# Altium project DeerDongle.PrjPcb
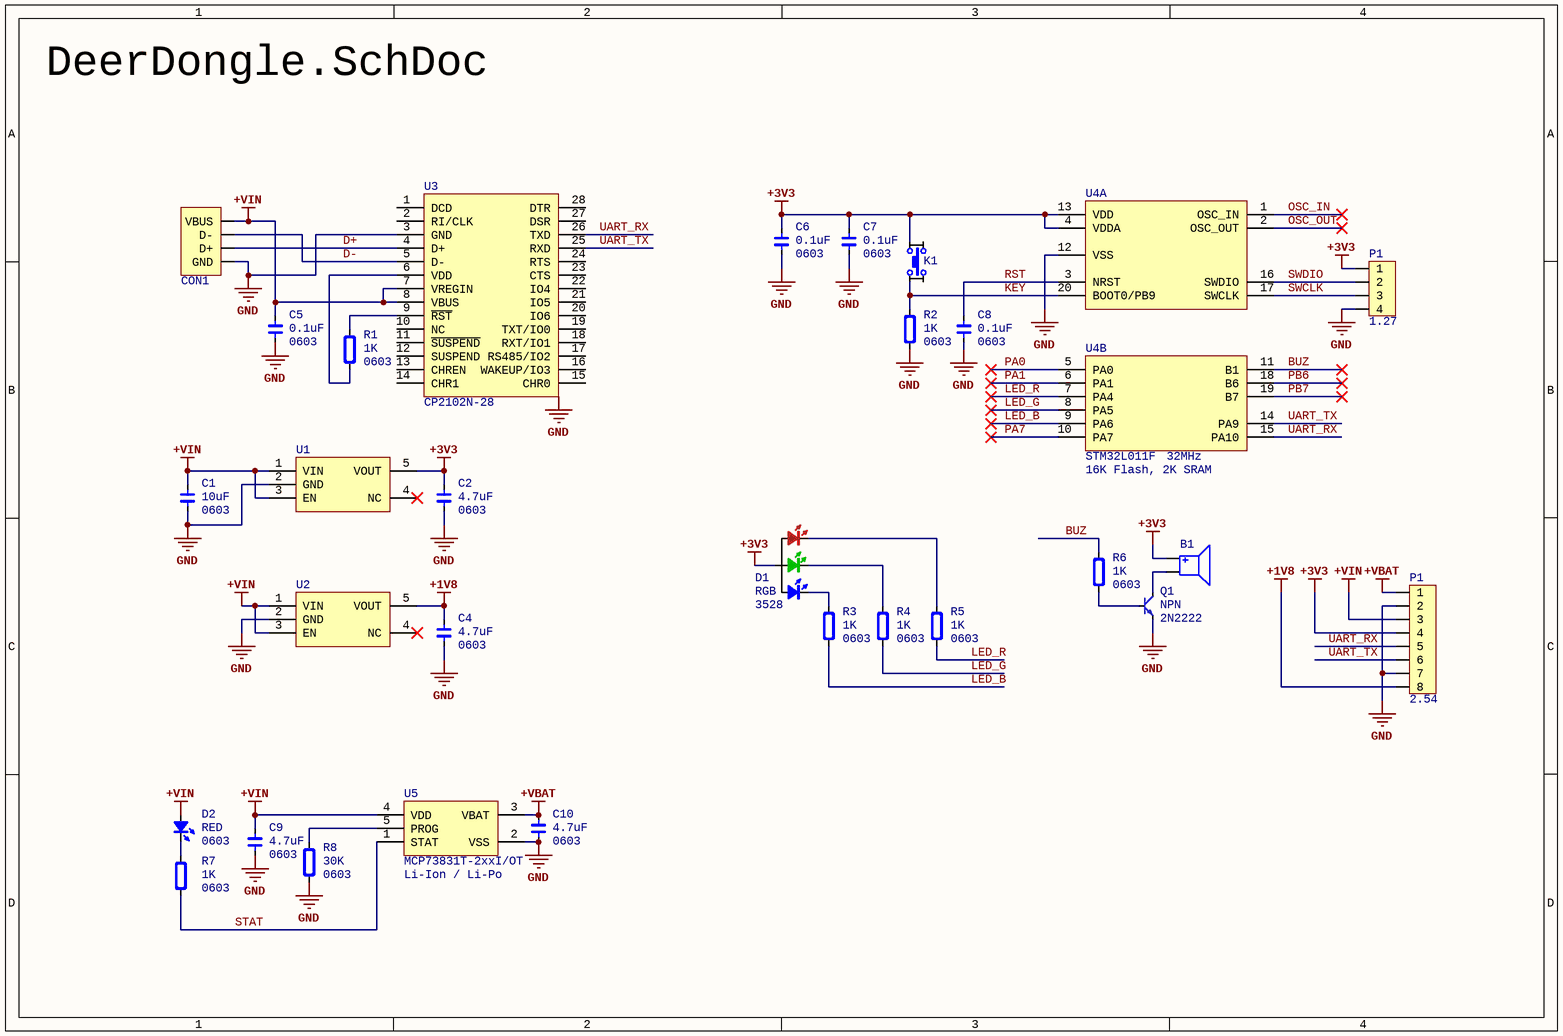
[diagram p0: DeerDongle.SchDoc]
1 sheet, 30 parts. Net scope: global (net labels, ports and power ports of the same name join across sheets).
Board file: DeerDongle.PcbDoc

## Sheet DeerDongle.SchDoc
size 292 x 193 mm

### Parts
(Parts that share a designator on the sheet are numbered #1, #2 ... from top to bottom, then left to right.)
B1  Buzzer  [Buzzer_5.0x5.0x2.0]  (value not drawn)
C1  value 10uF  Type: 0603  [CAP_0603]  (hidden comment: C0603)
C2  value 4.7uF  Type: 0603  [CAP_0603]  (hidden comment: C0603)
C4  value 4.7uF  Type: 0603  [CAP_0603]  (hidden comment: C0603)
C5  value 0.1uF  Type: 0603  [CAP_0603]  (hidden comment: C0603)
C6  value 0.1uF  Type: 0603  [CAP_0603]  (hidden comment: C0603)
C7  value 0.1uF  Type: 0603  [CAP_0603]  (hidden comment: C0603)
C8  value 0.1uF  Type: 0603  [CAP_0603]  (hidden comment: C0603)
C9  value 4.7uF  Type: 0603  [CAP_0603]  (hidden comment: C0603)
C10  value 4.7uF  Type: 0603  [CAP_0603]  (hidden comment: C0603)
CON1  USB_Plug_TypeA  [USB_TypeA_Plug_PCB]  (value not drawn)
D1  value RGB  Type: 3528  [LED_3528_RGB]  (hidden comment: D3528)
D2  value RED  Type: 0603  [LED_0603_RED]  (hidden comment: D0603)
K1  TACT  [Button_TACT_180_4P_3.0x3.5]  (value not drawn)
P1#1  value 1.27  [HDR1X4_1.27_180]  (hidden comment: HDR1x4)
P1#2  value 2.54  [HDR1X8_2.54_180H]  (hidden comment: HDR1x8)
Q1  Note: NPN  [SOT23-3]  (hidden comment: 2N2222)
R1  value 1K  Type: 0603  [RES_0603]  (hidden comment: R0603)
R2  value 1K  Type: 0603  [RES_0603]  (hidden comment: R0603)
R3  value 1K  Type: 0603  [RES_0603]  (hidden comment: R0603)
R4  value 1K  Type: 0603  [RES_0603]  (hidden comment: R0603)
R5  value 1K  Type: 0603  [RES_0603]  (hidden comment: R0603)
R6  value 1K  Type: 0603  [RES_0603]  (hidden comment: R0603)
R7  value 1K  Type: 0603  [RES_0603]  (hidden comment: R0603)
R8  value 30K  Type: 0603  [RES_0603]  (hidden comment: R0603)
U1  XC6220B331  [SOT23-5]  (value not drawn)
U2  XC6220B331  [SOT23-5]  (value not drawn)
U3  CP2102N-28  [QFN28_P0.5_5.0x5.0_H]
U4  STM32L011F  [QFN20_P0.5_3.0x3.0]  (value not drawn)  (parts A,B of 2)
U5  MCP73831T-2xxI/OT  Specification: Li-Ion / Li-Po  [SOT23-5]

### Nets
+1V8: C4.2 P1#2.8 U2.5(VOUT)
+3V3: B1.P(Positive) C2.2 C6.2 C7.2 D1.4(A) K1.3 P1#1.1 P1#2.4 U1.5(VOUT) U4.4(VDDA) U4.13(VDD)
+VBAT: C10.2 P1#2.1 U5.3(VBAT)
+VIN: C1.2 C5.2 C9.2 CON1.1(VBUS) D2.1(ANODE) P1#2.3 U1.1(VIN) U1.3(EN) U2.1(VIN) U2.3(EN) U3.7(VREGIN) U3.8(VBUS) U5.4(VDD)
GND: C1.1 C2.1 C4.1 C5.1 C6.1 C7.1 C8.1 C9.1 C10.1 CON1.4(GND) P1#1.4 P1#2.2 P1#2.7 Q1.2(E) R2.1 R8.1 U1.2(GND) U2.2(GND) U3.3(GND) U3.29(PAD) U4.12(VSS) U5.2(VSS)
BUZ: R6.1 U4.11(B1)
D+: CON1.3(D+) U3.4(D+)
D-: CON1.2(D-) U3.5(D-)
KEY: K1.1 R2.2 U4.20(BOOT0/PB9)
LED_B: R3.1 U4.9(PA6)
LED_G: R4.1 U4.8(PA5)
LED_R: R5.1 U4.7(PA4)
OSC_IN: U4.1(OSC_IN)
OSC_OUT: U4.2(OSC_OUT)
PA0: U4.5(PA0)
PA1: U4.6(PA1)
PA7: U4.10(PA7)
PB6: U4.18(B6)
PB7: U4.19(B7)
RST: C8.2 U4.3(NRST)
STAT: R7.1 U5.1(STAT)
SWCLK: P1#1.3 U4.17(SWCLK)
SWDIO: P1#1.2 U4.16(SWDIO)
UART_RX: P1#2.5 U3.26(TXD) U4.15(PA10)
UART_TX: P1#2.6 U3.25(RXD) U4.14(PA9)
NetB1_N: B1.N(Negative) Q1.3(C)
NetD1_1: D1.1(R) R5.2
NetD1_2: D1.2(G) R4.2
NetD1_3: D1.3(B) R3.2
NetD2_2: D2.2(CATHODE) R7.2
NetQ1_1: Q1.1(B) R6.2
NetR1_1: R1.1 U3.6(VDD)
NetR1_2: R1.2 U3.9(~{RST})
NetR8_2: R8.2 U5.5(PROG)

Not connected (* = marked no-connect by the designer): CON1 SH; K1 2 4; U1 4(NC)*; U2 4(NC)*; U3 1(DCD) 2(RI/CLK) 10(NC) 11(~{SUSPEND}) 12(SUSPEND) 13(CHREN) 14(CHR1) 15(CHR0) 16(WAKEUP/IO3) 17(RS485/IO2) 18(RXT/IO1) 19(TXT/IO0) 20(IO6) 21(IO5) 22(IO4) 23(CTS) 24(RTS) 27(DSR) 28(DTR)

### Notes on the sheet
- Title
- Size:
- Date:
- A4
- Number:
- Time:
- Revision:
- Sheet
- of
- File:

### Library data of the parts
B1 = Buzzer_5x5: Specification: 5.0x5.0mm; Value: *; Type: SMD3; Link: *; Note: *; Manufacturer: *; Datasheet: *
C1 C2 C4-C10 = Cap_0603: Capacitor; Specification: X7R, 16V; Note: ±10%; Manufacturer: *; Link: *
CON1 = USB_TypeA_Plug: USB; Value: Type A; Type: Male; Link: *; Manufacturer: *; Datasheet: *
D1 = LED_3528_RGB: LED; Manufacturer: *; Specification: *; Note: *; Link: *
D2 = LED_0603: LED; Manufacturer: Everlight Electronics; Specification: *; Note: *; Link: *
K1 = Button_TACT_180_4P_3.0x3.5: Button; Value: 4P; Specification: 3.0x3.5mm; Type: TACT; Link: *; Datasheet: *; Manufacturer: *; Note: *
P1#1 = HDR1x4_1.27: Header; Note: 1x4; Type: DIP
P1#2 = HDR1x8_2.54: Header; Note: 1x8; Type: DIP
Q1 = BJT_NPN: Transistor; Manufacturer: *; Specification: *; Link: *; Value: 2N2222; Type: SOT23-3
R1-R8 = Res_0603: Resistor; Specification: 1/10W; Note: ±1%; Manufacturer: *; Link: *
U1 U2 = XC6220x_SOT25: LDO; Manufacturer: Torex Semiconductor; Value: 3.3V; Specification: 1000mA; Note: 6.5V; Type: SOT23-5; Datasheet: https://www.torexsemi.com/file/xc6220/XC6220.pdf; Link: https://www.torexsemi.com/products/single-type-voltage-regulators/series/?name=xc6220
U3 = CP2102N-28: USB2UART; Manufacturer: Silicon Laboratories; Type: QFN28 P0.5; Value: *; Note: *; Specification: *; Datasheet: https://www.silabs.com/documents/public/data-sheets/cp2102n-datasheet.pdf; Link: https://www.silabs.com/interface/usb-bridges/usbxpress/device.cp2102n-gqfn28
U4 = STM32L011F: MCU ST; Manufacturer: STMicroelectronics; Value: 32MHz; Note: CortexM0; Specification: 16K Flash, 2K SRAM; Type: QFN20; Datasheet: https://www.st.com/resource/en/datasheet/stm32l011f3.pdf; Link: https://www.st.com/en/microcontrollers-microprocessors/stm32l011f3.html
U5 = MCP73831_SOT25: Charge; Manufacturer: Microchip; Type: SOT23-5; Value: *; Datasheet: http://ww1.microchip.com/downloads/en/DeviceDoc/MCP73831-Family-Data-Sheet-DS20001984H.pdf; Link: https://www.microchip.com/wwwproducts/en/en024903; Note: *